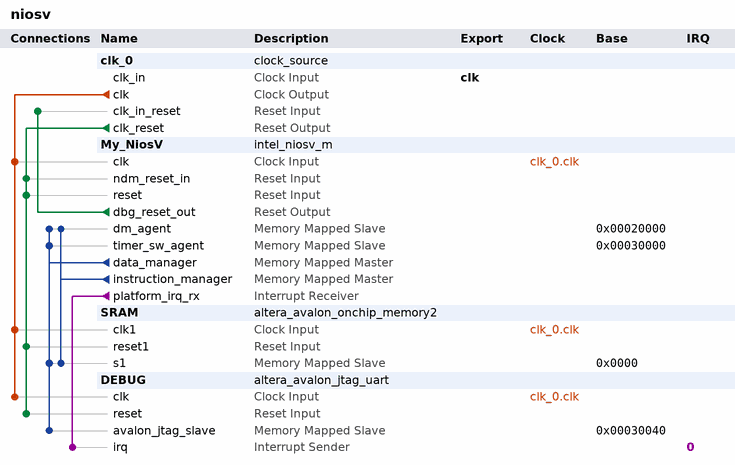
[diagram p0: system contents]
# Platform Designer (Qsys) system niosv, MAX 10 10M50DAF484C7G
# Parameters at their usual value, and those the tool derives, are not listed.
package require -exact qsys 25.1
create_system niosv
set_project_property DEVICE_FAMILY {MAX 10}
set_project_property DEVICE 10M50DAF484C7G

add_instance clk_0 clock_source 25.1
set_instance_parameter_value clk_0 clockFrequency 50000000

add_instance My_NiosV intel_niosv_m 26.0.0
set_instance_parameter_value My_NiosV enableAvalonInterface false
set_instance_parameter_value My_NiosV enableDebugReset true
set_instance_parameter_value My_NiosV enableECCFull false
set_instance_parameter_value My_NiosV enableECCLite false
set_instance_parameter_value My_NiosV hartId 0
set_instance_parameter_value My_NiosV interruptMode 0
set_instance_parameter_value My_NiosV pipelineArch true
set_instance_parameter_value My_NiosV resetSlave SRAM.s1

add_instance SRAM altera_avalon_onchip_memory2 25.1
set_instance_parameter_value SRAM dataWidth 32
set_instance_parameter_value SRAM dualPort false
set_instance_parameter_value SRAM initMemContent true
set_instance_parameter_value SRAM initializationFileName onchip_mem.hex
set_instance_parameter_value SRAM memorySize 131072

add_instance DEBUG altera_avalon_jtag_uart 25.1
set_instance_parameter_value DEBUG simInteractiveOptions NO_INTERACTIVE_WINDOWS

# connections
add_connection clk_0.clk DEBUG.clk clock
add_connection clk_0.clk My_NiosV.clk clock
add_connection clk_0.clk SRAM.clk1 clock
add_connection clk_0.clk_reset DEBUG.reset reset
add_connection clk_0.clk_reset My_NiosV.ndm_reset_in reset
add_connection clk_0.clk_reset My_NiosV.reset reset
add_connection clk_0.clk_reset SRAM.reset1 reset
add_connection My_NiosV.dbg_reset_out clk_0.clk_in_reset reset
add_connection My_NiosV.data_manager DEBUG.avalon_jtag_slave avalon
set_connection_parameter_value My_NiosV.data_manager/DEBUG.avalon_jtag_slave baseAddress 0x00030040
add_connection My_NiosV.data_manager My_NiosV.dm_agent avalon
set_connection_parameter_value My_NiosV.data_manager/My_NiosV.dm_agent baseAddress 0x00020000
add_connection My_NiosV.data_manager My_NiosV.timer_sw_agent avalon
set_connection_parameter_value My_NiosV.data_manager/My_NiosV.timer_sw_agent baseAddress 0x00030000
add_connection My_NiosV.data_manager SRAM.s1 avalon
set_connection_parameter_value My_NiosV.data_manager/SRAM.s1 baseAddress 0x0000
add_connection My_NiosV.instruction_manager My_NiosV.dm_agent avalon
set_connection_parameter_value My_NiosV.instruction_manager/My_NiosV.dm_agent baseAddress 0x00020000
add_connection My_NiosV.instruction_manager SRAM.s1 avalon
set_connection_parameter_value My_NiosV.instruction_manager/SRAM.s1 baseAddress 0x0000
add_connection My_NiosV.platform_irq_rx DEBUG.irq interrupt
set_connection_parameter_value My_NiosV.platform_irq_rx/DEBUG.irq irqNumber 0

# exported interfaces
add_interface clk clock sink
set_interface_property clk EXPORT_OF clk_0.clk_in

set_interconnect_requirement {$system} qsys_mm.clockCrossingAdapter HANDSHAKE
set_interconnect_requirement {$system} qsys_mm.enableEccProtection FALSE
set_interconnect_requirement {$system} qsys_mm.insertDefaultSlave FALSE
set_interconnect_requirement {$system} qsys_mm.maxAdditionalLatency 1

save_system niosv.qsys
